# Altium schematic sheet FrontEnd-rev1-superseded.SchDoc
size A4
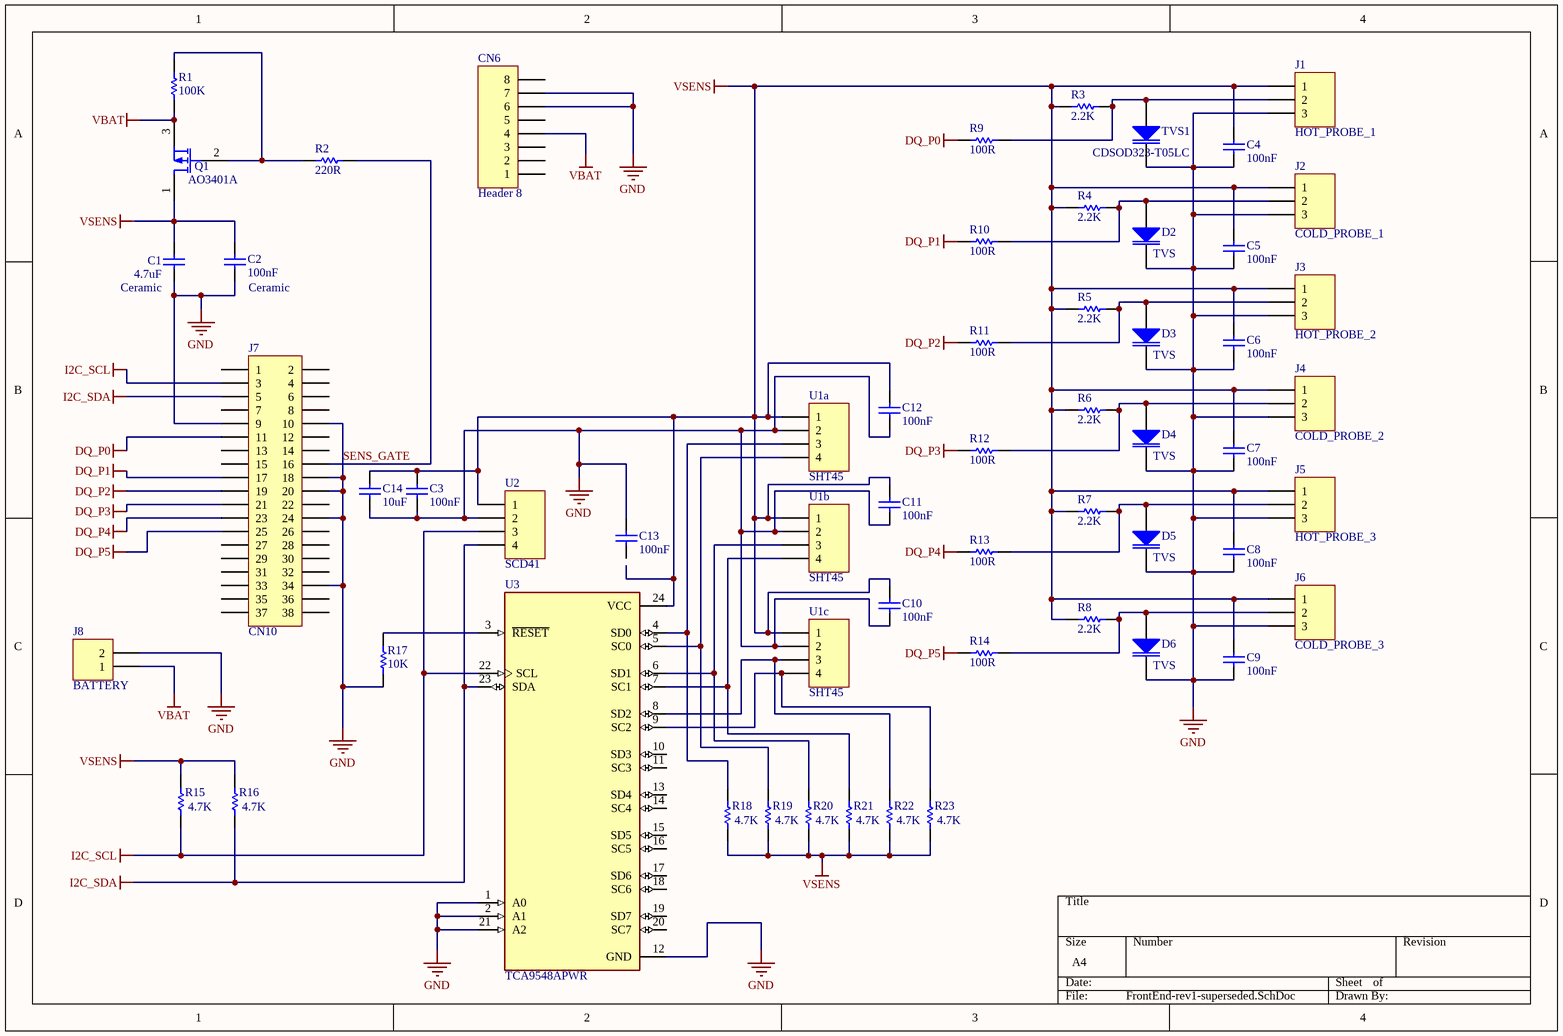
[diagram p0: FrontEnd-rev1-superseded.SchDoc]

## Parts
C1  Ceramic  value 4.7uF  [RAD-0.3]
C2  Ceramic  value 100nF  [RAD-0.3]
C3  100nF  [RAD-0.3]
C4  100nF  [RAD-0.3]
C5  100nF  [RAD-0.3]
C6  100nF  [RAD-0.3]
C7  100nF  [RAD-0.3]
C8  100nF  [RAD-0.3]
C9  100nF  [RAD-0.3]
C10  100nF  [RAD-0.3]
C11  100nF  [RAD-0.3]
C12  100nF  [RAD-0.3]
C13  100nF  [RAD-0.3]
C14  value 10uF  [RAD-0.3]  (hidden comment: 100nF)
CN6  Header 8  [HDR1X8]
D2  TVS  [SOT23_N]
D3  TVS  [SOT23_N]
D4  TVS  [SOT23_N]
D5  TVS  [SOT23_N]
D6  TVS  [SOT23_N]
J1  HOT_PROBE_1  [HDR1X3]
J2  COLD_PROBE_1  [HDR1X3]
J3  HOT_PROBE_2  [HDR1X3]
J4  COLD_PROBE_2  [HDR1X3]
J5  HOT_PROBE_3  [HDR1X3]
J6  COLD_PROBE_3  [HDR1X3]
J7  CN10  [HDR2X19]
J8  BATTERY  [HDR1X2]
Q1  AO3401A  [E3]
R1  100K  [AXIAL-0.3]
R2  220R  [AXIAL-0.3]
R3  value 2.2K  [AXIAL-0.3]  (hidden comment: pullup)
R4  value 2.2K  [AXIAL-0.3]  (hidden comment: pullup)
R5  value 2.2K  [AXIAL-0.3]  (hidden comment: pullup)
R6  value 2.2K  [AXIAL-0.3]  (hidden comment: pullup)
R7  value 2.2K  [AXIAL-0.3]  (hidden comment: pullup)
R8  value 2.2K  [AXIAL-0.3]  (hidden comment: pullup)
R9  100R  [AXIAL-0.3]
R10  100R  [AXIAL-0.3]
R11  100R  [AXIAL-0.3]
R12  100R  [AXIAL-0.3]
R13  100R  [AXIAL-0.3]
R14  100R  [AXIAL-0.3]
R15  value 4.7K  [AXIAL-0.3]  (hidden comment: pullup)
R16  value 4.7K  [AXIAL-0.3]  (hidden comment: pullup)
R17  value 10K  [AXIAL-0.3]  (hidden comment: 220R)
R18  value 4.7K  [AXIAL-0.3]  (hidden comment: pullup)
R19  value 4.7K  [AXIAL-0.3]  (hidden comment: pullup)
R20  value 4.7K  [AXIAL-0.3]  (hidden comment: pullup)
R21  value 4.7K  [AXIAL-0.3]  (hidden comment: pullup)
R22  value 4.7K  [AXIAL-0.3]  (hidden comment: pullup)
R23  value 4.7K  [AXIAL-0.3]  (hidden comment: pullup)
TVS1  CDSOD323-T05LC  [SOT23_N]
U1a  SHT45  [HDR1X4]
U1b  SHT45  [HDR1X4]
U1c  SHT45  [HDR1X4]
U2  SCD41  [HDR1X4]
U3  TCA9548APWR  [SOP65P640X120-24N]

## Nets
DQ_P0: J7.11 R9.1
DQ_P1: J7.17 R10.1
DQ_P2: J7.19 R11.1
DQ_P3: J7.21 R12.1
DQ_P4: J7.23 R13.1
DQ_P5: J7.25 R14.1
I2C_SCL: J7.3 R15.1 U2.3 U3.22(SCL)
I2C_SDA: J7.5 R16.1 U2.4 U3.23(SDA)
SENS_GATE: C1.2 C2.2 C3.2 C4.2 C5.2 C6.2 C7.2 C8.2 C9.2 C10.2 C11.2 C12.2 C13.1 C14.2 CN6.6 CN6.7 D2.1(K) D3.1(K) D4.1(K) D5.1(K) D6.1(K) J1.3 J2.3 J3.3 J4.3 J5.3 J6.3 J7.9 J7.10 J7.16 J7.18 J7.20 J7.24 J7.34 J8.2 R2.1 R17.2 TVS1.1(K) U1a.2 U1b.2 U1c.2 U2.2 U3.1(A0) U3.2(A1) U3.12(GND) U3.21(A2)  [also labelled GND]
VBAT: CN6.4 J8.1 Q1.3(S) R1.2
VSENS: C1.1 C2.1 C3.1 C4.1 C5.1 C6.1 C7.1 C8.1 C9.1 C10.1 C11.1 C12.1 C14.1 J1.1 J2.1 J3.1 J4.1 J5.1 J6.1 Q1.1(D) R3.2 R4.2 R5.2 R6.2 R7.2 R8.2 R15.2 R16.2 R18.1 R19.1 R20.1 R21.1 R22.1 R23.1 U1a.1 U1b.1 U1c.1 U2.1 U3.24(VCC)
NetD2_3: D2.3(A) J2.2 R4.1 R10.2
NetD3_3: D3.3(A) J3.2 R5.1 R11.2
NetD4_3: D4.3(A) J4.2 R6.1 R12.2
NetD5_3: D5.3(A) J5.2 R7.1 R13.2
NetD6_3: D6.3(A) J6.2 R8.1 R14.2
NetJ1_2: J1.2 R3.1 R9.2 TVS1.3(A)
NetQ1_2: Q1.2(G) R1.1 R2.2
NetR17_1: R17.1 U3.3(~{RESET})
NetR18_2: R18.2 U1a.3 U3.4(SD0)
NetR19_2: R19.2 U1a.4 U3.5(SC0)
NetR20_2: R20.2 U1b.3 U3.6(SD1)
NetR21_2: R21.2 U1b.4 U3.7(SC1)
NetR22_2: R22.2 U1c.3 U3.8(SD2)
NetR23_2: R23.2 U1c.4 U3.9(SC2)

Not connected (* = marked no-connect by the designer): C13 2; CN6 1 2 3 5 8; J7 1 2 4 6 7 8 12 13 14 15 22 26 27 28 29 30 31 32 33 35 36 37 38; U3 10(SD3) 11(SC3) 13(SD4) 14(SC4) 15(SD5) 16(SC5) 17(SD6) 18(SC6) 19(SD7) 20(SC7)

## Library data of the parts
C1-C14 = Cap: Capacitor; Published: 8-Jun-2000; LatestRevisionDate: 17-Jul-2002; LatestRevisionNote: Re-released for DXP Platform.; PackageReference: RAD-0.3; Publisher: Altium Limited; PackageDescription: Radial Cap, Thru-Hole; 2 Leads; 0.3 in Pin Spacing
  C3-C13: Value: 100nF
CN6 = Header 8: Header, 8-Pin; LatestRevisionDate: 17-Jul-2002; LatestRevisionNote: Re-released for DXP Platform.; Publisher: Altium Limited
D2-D6 TVS1 = Diode BBY40: SOT23 Silicon Planar Variable Capacitance Diode; Note: Pin 2 is not connected and not drawn.; Published: 8-Jun-2000; LatestRevisionDate: 29-May-2009; LatestRevisionNote: IPC-7351 Footprint Added.; DatasheetVersion: Jan-1998; PackageVersion: 1996; PackageReference: SOT23; Publisher: Altium Limited; PackageDescription: 3-Pin SOT-23 Package 0.95 mm Pitch, 2.3 mm Lead Span - Reverse Pinning; ComponentLink1Description: Manufacturer Link; ComponentLink1URL: http://www.zetex.com/; ComponentLink2Description: Datasheet; ComponentLink2URL: www.zetex.com/3.0/pdf/BBY40.pdf
J1-J6 = Header 3: Header, 3-Pin; LatestRevisionDate: 17-Jul-2002; LatestRevisionNote: Re-released for DXP Platform.; Publisher: Altium Limited
J7 = Header 19X2: Header, 19-Pin, Dual row; LatestRevisionDate: 17-Jul-2002; LatestRevisionNote: Re-released for DXP Platform.; Publisher: Altium Limited
J8 = Header 2: Header, 2-Pin; LatestRevisionDate: 17-Jul-2002; LatestRevisionNote: Re-released for DXP Platform.; Publisher: Altium Limited
Q1 = MOSFET-P: P-Channel MOSFET; Published: 8-Jun-2000; LatestRevisionDate: 17-Jul-2002; LatestRevisionNote: Re-released for DXP Platform.; PackageVersion: 1995/1996; PackageReference: E3; Publisher: Altium Limited; PackageDescription: TO, Flat Index; 3 In-Line, Axial Leads; Body Dia. 4.6mm; Lead Dia. 0.5 mm (max)
R1-R23 = Res1: Resistor; Published: 8-Jun-2000; LatestRevisionDate: 17-Jul-2002; LatestRevisionNote: Re-released for DXP Platform.; PackageReference: AXIAL-0.3; Publisher: Altium Limited; PackageDescription: Axial Device, Thru-Hole; 2 Leads; 0.3 in Pin Spacing
  R1: Value: 100K
  R2: Value: 220R
  R9-R14: Value: 100R
U1a U1b U1c U2 = Header 4: Header, 4-Pin; LatestRevisionDate: 17-Jul-2002; LatestRevisionNote: Re-released for DXP Platform.; Publisher: Altium Limited
U3 = TCA9548APWR: 8-channel 1.65- to 5.5-V I2C/SMBus switch with reset & voltage translation; MF: Texas Instruments; SnapEDA_Link: https://www.snapeda.com/parts/TCA9548APWR/Texas+Instruments/view-part/?ref=snap; Package: TSSOP-24 Texas Instruments; Value: *; MP: TCA9548APWR; Check_prices: https://www.snapeda.com/parts/TCA9548APWR/Texas+Instruments/view-part/?ref=eda